# EAGLE design OpenROV Cape (EAGLE 6.2)
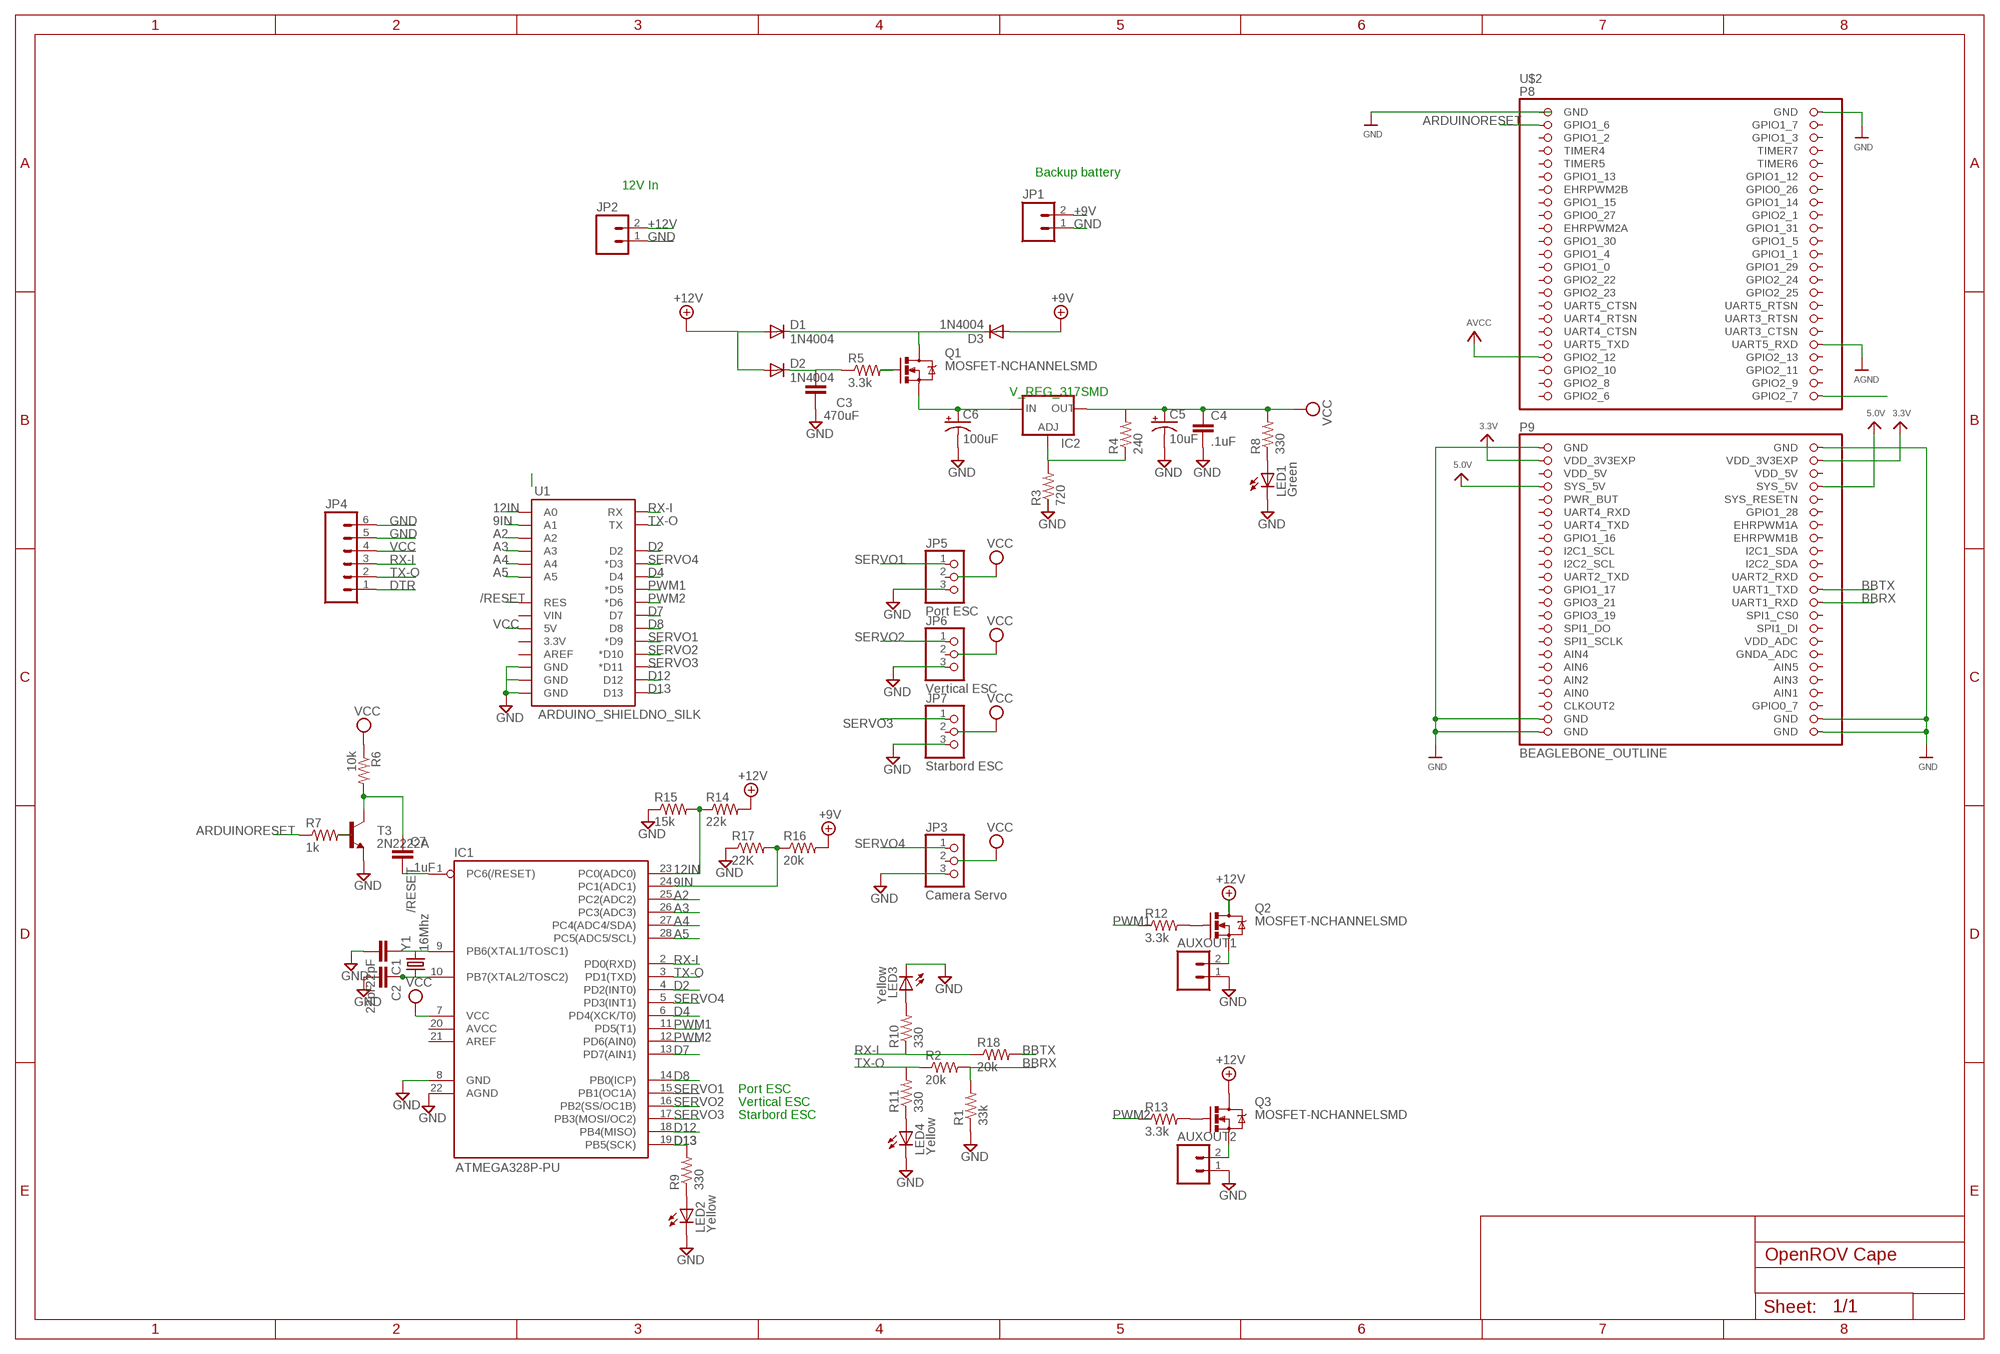
[diagram p0: schematic, sheet 1]

## Parts
AUXOUT1  M02PTH  [1X02]
AUXOUT2  M02PTH  [1X02]
C1  22pF  CAP0805  [0805]
C2  22pF  CAP0805  [0805]
C3  470uF  CAP0805  [0805]
C4  .1uF  CAP0805  [0805]
C5  10uF  CAP_POL1206  [EIA3216]
C6  100uF  CAP_POL1206  [EIA3216]
C7  .1uF  CAP0805  [0805]
D1  1N4004  DIODESMA  [SMA-DIODE]
D2  1N4004  DIODESMA  [SMA-DIODE]
D3  1N4004  DIODESMA  [SMA-DIODE]
IC1  ATMEGA328P-PU  AVR-MEGA8-PPTH  [DIL28-3]
IC2  V_REG_317SMD  [SOT223]
JP1  M02PTH  [1X02]
JP2  M02PTH  [1X02]
JP3  Camera Servo  PINHD-1X3  [1X03]
JP4  M06SIP  [1X06]
JP5  Port ESC  PINHD-1X3  [1X03]
JP6  Vertical ESC  PINHD-1X3  [1X03]
JP7  Starbord ESC  PINHD-1X3  [1X03]
LED1  Green  LED1206  [LED-1206]
LED2  Yellow  LED1206  [LED-1206]
LED3  Yellow  LED1206  [LED-1206]
LED4  Yellow  LED1206  [LED-1206]
Q1  MOSFET-NCHANNELSMD  [SOT23-3]
Q2  MOSFET-NCHANNELSMD  [SOT23-3]
Q3  MOSFET-NCHANNELSMD  [SOT23-3]
R1  33k  RESISTOR0805-RES  [0805]
R2  20k  RESISTOR0805-RES  [0805]
R3  720  RESISTOR0805-RES  [0805]
R4  240  RESISTOR0805-RES  [0805]
R5  3.3k  RESISTOR0805-RES  [0805]
R6  10k  RESISTOR0805-RES  [0805]
R7  1k  RESISTOR0805-RES  [0805]
R8  330  RESISTOR0805-RES  [0805]
R9  330  RESISTOR0805-RES  [0805]
R10  330  RESISTOR0805-RES  [0805]
R11  330  RESISTOR0805-RES  [0805]
R12  3.3k  RESISTOR0805-RES  [0805]
R13  3.3k  RESISTOR0805-RES  [0805]
R14  22k  RESISTOR0805-RES  [0805]
R15  15k  RESISTOR0805-RES  [0805]
R16  20k  RESISTOR0805-RES  [0805]
R17  22K  RESISTOR0805-RES  [0805]
R18  20k  RESISTOR0805-RES  [0805]
T3  2N2222A  TRANSISTOR_NPNSOT23  [SOT23]
U1  ARDUINO_SHIELDNO_SILK  [DUEMILANOVE_VIAS]
U$2  BEAGLEBONE_OUTLINE  [BEAGLEBONE_SHIELD]
Y1  16Mhz  CRYSTALHC49US  [HC49US]

## Nets
3.3V: U$2.49(VDD_3V3EXP) U$2.50(VDD_3V3EXP)
5.0V: U$2.53(SYS_5V) U$2.54(SYS_5V)
9IN: IC1.24(PC1(ADC1)) R16.1 R17.2 U1.A1
12IN: IC1.23(PC0(ADC0)) R14.1 R15.2 U1.A0
+9V: D3.A JP1.2 R16.2
+12V: D1.A D2.A JP2.2 Q2.3(D) Q3.3(D) R14.2
/RESET: C7.1 R6.2 T3.3(C) U1.RES
A2: IC1.25(PC2(ADC2)) U1.A2
A3: IC1.26(PC3(ADC3)) U1.A3
A4: IC1.27(PC4(ADC4/SDA)) U1.A4
A5: IC1.28(PC5(ADC5/SCL)) U1.A5
AGND: U$2.38(UART5_RXD)
ARDUINORESET: R7.1 U$2.3(GPIO1_6)
AVCC: U$2.39(GPIO2_12)
BBRX: R1.2 R2.2 U$2.72(UART1_RXD)
BBTX: R18.2 U$2.70(UART1_TXD)
D2: IC1.4(PD2(INT0)) U1.D2
D4: IC1.6(PD4(XCK/T0)) U1.D4
D7: IC1.13(PD7(AIN1)) U1.D7
D8: IC1.14(PB0(ICP)) U1.D8
D12: IC1.18(PB4(MISO)) U1.D12
D13: IC1.19(PB5(SCK)) R9.2 U1.D13
DTR: JP4.1
GND: AUXOUT1.1 AUXOUT2.1 C1.2 C2.2 C3.2 C4.2 C5.C(-) C6.C(-) IC1.22(AGND) JP1.1 JP2.1 JP3.3 JP4.5 JP4.6 JP5.3 JP6.3 JP7.3 LED1.C LED2.C LED3.C LED4.C R1.1 R3.1 R15.1 R17.1 T3.2(E) U1.GND@0(GND) U1.GND@1(GND) U1.GND@2(GND) U$2.2(GND) U$2.47(GND) U$2.48(GND) U$2.89(GND) U$2.90(GND) U$2.91(GND) U$2.92(GND)
N$1: LED3.A R10.2
N$4: C7.2 IC1.1(PC6(/RESET))
N$5: R7.2 T3.1(B)
N$7: IC2.1(ADJ) R3.2 R4.1
N$9: LED1.A R8.1
N$10: LED2.A R9.1
N$11: LED4.A R11.1
N$12: AUXOUT1.2 Q2.2(S)
N$13: Q2.1(G) R12.2
N$14: AUXOUT2.2 Q3.2(S)
N$15: Q3.1(G) R13.2
N$24: C2.1 IC1.10(PB7(XTAL2/TOSC2)) Y1.1
N$25: C1.1 IC1.9(PB6(XTAL1/TOSC1)) Y1.2
N$46: U$2.46(GPIO2_7)
N$71: C3.1 D2.C R5.1
N$73: Q1.1(G) R5.2
N$90: D1.C D3.C Q1.3(D)
N$91: C6.A(+) IC2.3(IN) Q1.2(S)
PWM1: IC1.11(PD5(T1)) R12.1 U1.D5(*D5)
PWM2: IC1.12(PD6(AIN0)) R13.1 U1.D6(*D6)
RX-I: IC1.2(PD0(RXD)) JP4.3 R10.1 R18.1 U1.RX
SERVO1: IC1.15(PB1(OC1A)) JP5.1 U1.D9(*D9)
SERVO2: IC1.16(PB2(SS/OC1B)) JP6.1 U1.D10(*D10)
SERVO3: IC1.17(PB3(MOSI/OC2)) JP7.1 U1.D11(*D11)
SERVO4: IC1.5(PD3(INT1)) JP3.1 U1.D3(*D3)
TX-O: IC1.3(PD1(TXD)) JP4.2 R2.1 R11.2 U1.TX
VCC: C4.1 C5.A(+) IC1.7(VCC) IC2.2(OUT) JP4.4 R4.2 R6.1 R8.2 U1.5V
Unconnected: IC1.8(GND) IC1.20(AVCC) IC1.21(AREF) JP3.2 JP5.2 JP6.2 JP7.2 U1.3.3V U1.AREF U1.VIN U$2.5(GPIO1_2) U$2.6(GPIO1_3) U$2.7(TIMER4) U$2.8(TIMER7) U$2.9(TIMER5) U$2.10(TIMER6) U$2.11(GPIO1_13) U$2.12(GPIO1_12) U$2.13(EHRPWM2B) U$2.14(GPIO0_26) U$2.15(GPIO1_15) U$2.16(GPIO1_14) U$2.17(GPIO0_27) U$2.18(GPIO2_1) U$2.19(EHRPWM2A) U$2.20(GPIO1_31) U$2.21(GPIO1_30) U$2.22(GPIO1_5) U$2.23(GPIO1_4) U$2.24(GPIO1_1) U$2.25(GPIO1_0) U$2.26(GPIO1_29) U$2.27(GPIO2_22) U$2.28(GPIO2_24) U$2.29(GPIO2_23) U$2.30(GPIO2_25) U$2.31(UART5_CTSN) U$2.32(UART5_RTSN) U$2.33(UART4_RTSN) U$2.34(UART3_RTSN) U$2.35(UART4_CTSN) U$2.36(UART3_CTSN) U$2.37(UART5_TXD) U$2.40(GPIO2_13) U$2.41(GPIO2_10) U$2.55(PWR_BUT) U$2.56(SYS_RESETN) U$2.57(UART4_RXD) U$2.58(GPIO1_28) U$2.59(UART4_TXD) U$2.60(EHRPWM1A) U$2.61(GPIO1_16) U$2.62(EHRPWM1B) U$2.63(I2C1_SCL) U$2.64(I2C1_SDA) U$2.65(I2C2_SCL) U$2.66(I2C2_SDA) U$2.67(UART2_TXD) U$2.68(UART2_RXD) U$2.69(GPIO1_17) U$2.71(GPIO3_21) U$2.73(GPIO3_19) U$2.74(SPI1_CS0) U$2.75(SPI1_DO) U$2.76(SPI1_DI) U$2.77(SPI1_SCLK) U$2.78(VDD_ADC) U$2.79(AIN4) U$2.80(GNDA_ADC) U$2.81(AIN6) U$2.82(AIN5) U$2.83(AIN2) U$2.86(AIN1) U$2.87(CLKOUT2) U$2.88(GPIO0_7)

## Notes on the sheet
- Backup battery
- 12V In
- V_REG_317SMD
- Port ESC
- Vertical ESC
- Starbord ESC

## Power pins joined to a net without a drawn wire
AIN0: U$2.85(AIN0)
AIN3: U$2.84(AIN3)
GND: U$2.1(GND)
GPIO1_7: U$2.4(GPIO1_7)
GPIO2_6: U$2.45(GPIO2_6)
GPIO2_8: U$2.43(GPIO2_8)
GPIO2_9: U$2.44(GPIO2_9)
GPIO2_11: U$2.42(GPIO2_11)
VDD_5V: U$2.51(VDD_5V) U$2.52(VDD_5V)

## Library data of the parts
AUXOUT1 AUXOUT2 JP1 JP2 = SparkFun:M02: Header 2 Standard 2-pin 0.1" header. Use with straight break away headers (SKU : PRT-00116), right angle break away headers (PRT-00553), swiss pins (PRT-00743), machine pins (PRT-00117), and female headers (PRT-00115). Molex polarized connector foot print use with SKU : PRT-08233 with associated crimp pins and housings.
C1-C4 C7 = SparkFun-Passives:CAP: Capacitor Standard 0603 ceramic capacitor, and 0.1" leaded capacitor.
C5 C6 = SparkFun-Passives:CAP_POL: Capacitor Polarized These are standard SMD and PTH capacitors. Normally 10uF, 47uF, and 100uF in electrolytic and tantalum varieties. Always verify the external diameter of the through hole cap, it varies with capacity, voltage, and manufacturer. The EIA devices should be standard.
D1-D3 = SparkFun-DiscreteSemi:DIODE: Diode These are standard reverse protection diodes and small signal diodes. SMA package can handle up to about 1A. SOD-323 can handle about 200mA. What the SOD-323 package when ordering, there are some mfgs out there that are 5-pin packages.
IC1 = SparkFun:AVR-MEGA8-P: MICROCONTROLLER 8 Kbytes FLASH 1 kbytes SRAM 512 bytes EEPROM USART 4-channel 10 bit ADC 2-channel 8 bit ADC
IC2 = SparkFun-PowerIC:V_REG_317: Voltage Regulator Standard LM317 adjustable voltage regulator. AOI (Adjust Output Input). Google 'LM317 Calculator' for easy to use app to get the two resistor values needed. 240/720 for 5V output. 240/390 for 3.3V output. Spark Fun Electronics SKU : COM-00527
JP3 JP5-JP7 = pinhead:PINHD-1X3: PIN HEADER
JP4 = SparkFun-Connectors:M06: Header 6 Standard 6-pin 0.1" header. Use with straight break away headers (SKU : PRT-00116), right angle break away headers (PRT-00553), swiss pins (PRT-00743), machine pins (PRT-00117), and female headers (PRT-00115). Molex polarized connector foot print use with SKU : PRT-08094 with associated crimp pins and housings. NOTES ON THE VARIANTS LOCK and LOCK_LONGPADS... This footprint was designed to help hold the alignment of a through-hole component (i.e. 6-pin header) while soldering it into place. You may notice that each hole has been shifted either up or down by 0.005 of an inch from it's more standard position (which is a perfectly straight line). This slight alteration caused the pins (the squares in the middle) to touch the edges of the holes. Because they are alternating, it causes a "brace" to hold the component in place. 0.005 has proven to be the perfect amount of "off-center" position when using our standard breakaway headers. Although looks a little odd when you look at the bare footprint, once you have a header in there, the alteration is very hard to notice. Also, if you push a header all the way into place, it is covered up entirely on the bottom side. This idea of altering the position of holes to aid alignment will be further integrated into the Sparkfun Library for other footprints. It can help hold any component with 3 or more connection pins.
LED1-LED4 = SparkFun-LED:LED: LEDs Standard schematic elements and footprints for 5mm, 3mm, 1206, and 0603 sized LEDs. 5mm - Spark Fun Electronics SKU : COM-00529 (and others)
Q1-Q3 = SparkFun-DiscreteSemi:MOSFET-NCHANNEL: Generic NMOS footprint
R1-R18 = SparkFun-Passives:RESISTOR: Resistor Basic schematic elements and footprints for 0603, 1206, and PTH resistors.
T3 = SparkFun-DiscreteSemi:TRANSISTOR_NPN: Generic NPN BJT. MMBT2222 is the common NPN we use. Double check against datasheet- not all devices are the same!
U1 = SparkFun-Boards:ARDUINO_SHIELD: Arduino shield footprint
U$2 = microbuilder:BEAGLEBONE_OUTLINE
Y1 = SparkFun:CRYSTAL: Crystals Various standard crystals. Proven footprints. Spark Fun Electronics SKU : COM-00534

## Board
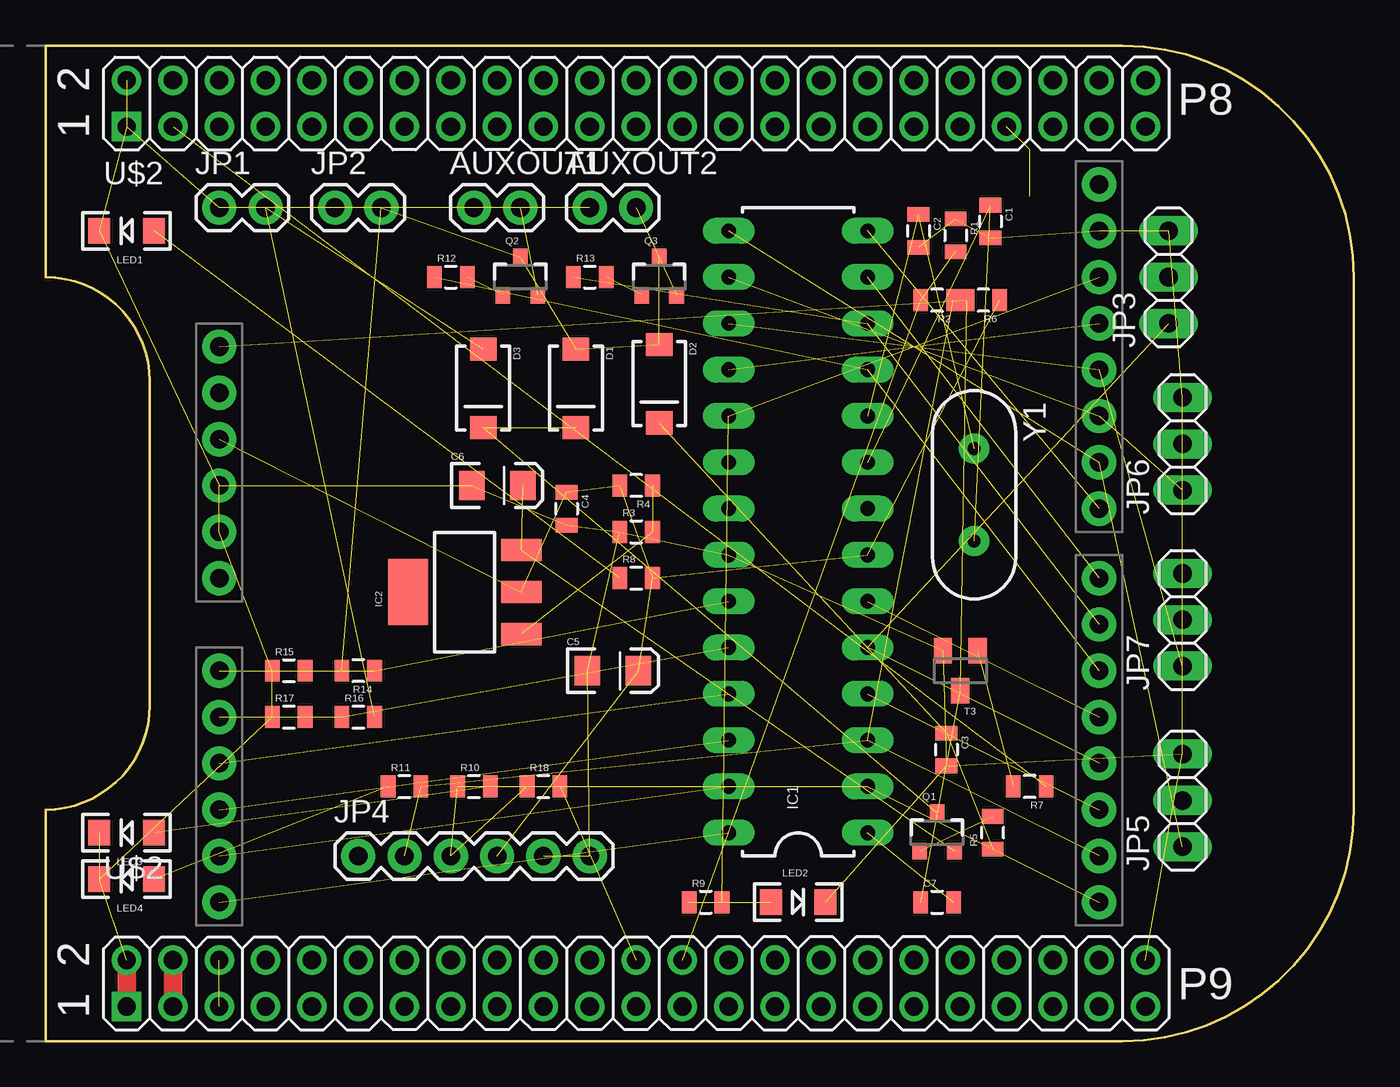
[diagram p1: board, top side]
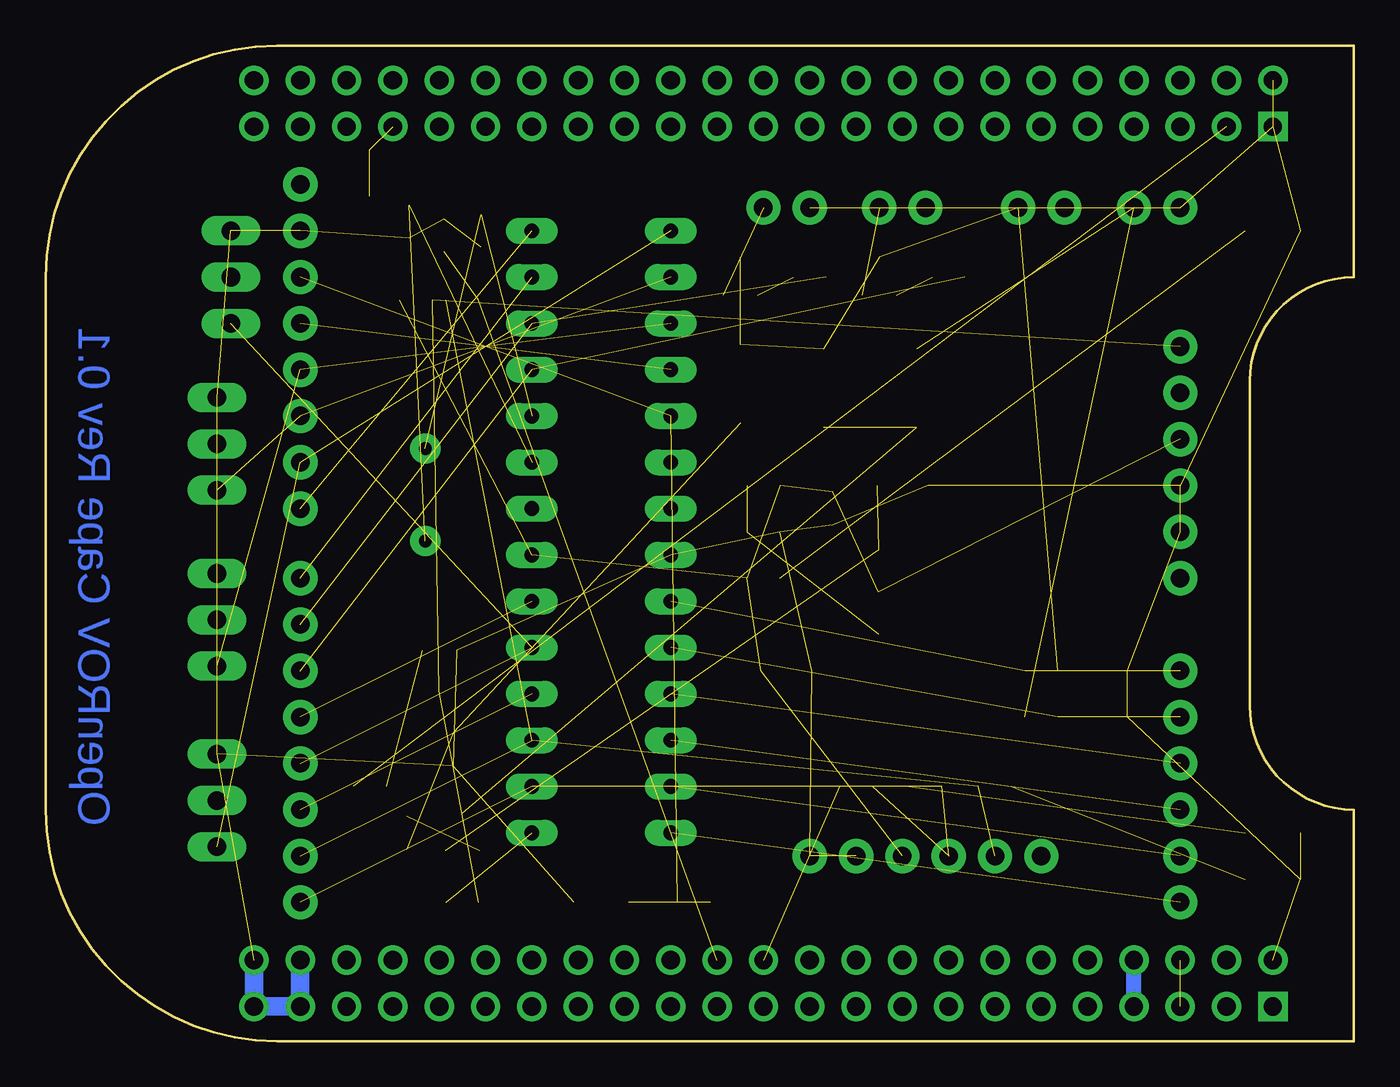
[diagram p2: board, bottom side, seen from below]

Size 71.75 x 54.61 mm. Coordinates in mm from the lower left corner, seen from the top.
Copper layers (1*16): Top 0.035mm / dielectric 1.5mm / Bottom 0.035mm
Design rules: minimum track width 10mil, minimum drill 20mil, track to track 10mil, track to pad 10mil, pad to pad 10mil, via to via 10mil, smd to smd 10mil, copper to edge 10mil, drill to drill 10mil, minimum pad ring 12mil, minimum via ring 10mil, stop-mask expansion 4mil, vias tented up to drill 25mil, thermal gap 10mil

### Footprints (pad centres in the part's own frame; a part is rotated, then mirrored left to right if it is on the bottom)
1X02 = drill 1.016 pad 1.88: 1 0,0; 2 2.54,0
0805 = smd 0.8 x 1.2: 1 -0.9,0; 2 0.9,0
EIA3216 = smd 1.4 x 1.6: A 1.4,0; C -1.4,0
SMA-DIODE = smd 1.27 x 1.47: A -2.15,0; C 2.15,0
DIL28-3 = drill 0.813 long: 1 -16.51,-3.81; 2 -13.97,-3.81; 3 -11.43,-3.81; 4 -8.89,-3.81; 5 -6.35,-3.81; 6 -3.81,-3.81; 7 -1.27,-3.81; 8 1.27,-3.81; 9 3.81,-3.81; 10 6.35,-3.81; 11 8.89,-3.81; 12 11.43,-3.81; 13 13.97,-3.81; 14 16.51,-3.81; 15 16.51,3.81; 16 13.97,3.81; 17 11.43,3.81; 18 8.89,3.81; 19 6.35,3.81; 20 3.81,3.81; 21 1.27,3.81; 22 -1.27,3.81; 23 -3.81,3.81; 24 -6.35,3.81; 25 -8.89,3.81; 26 -11.43,3.81; 27 -13.97,3.81; 28 -16.51,3.81
SOT223 = smd 1.219 x 2.235: 1 -2.311,-3.099; 2 0,-3.099; 3 2.311,-3.099 | smd 3.6 x 2.2: 4 0,3.099
1X03 = drill 1.016 long: 1 -2.54,0; 2 0,0; 3 2.54,0
1X06 = drill 1.016 pad 1.88: 1 0,0; 2 2.54,0; 3 5.08,0; 4 7.62,0; 5 10.16,0; 6 12.7,0
LED-1206 = smd 1.2 x 1.4: A -1.5,0; C 1.5,0
SOT23-3 = smd 0.8 x 0.9: 1 -0.95,-1; 2 0.95,-1; 3 0,1.1
SOT23 = smd 1 x 1.4: 1 -0.95,-1.1; 2 0.95,-1.1; 3 0,1.1
DUEMILANOVE_VIAS = drill 1.016 pad 1.88: 3.3V 50.8,13.97; 5V 50.8,16.51; A0 50.8,29.21; A1 50.8,31.75; A2 50.8,34.29; A3 50.8,36.83; A4 50.8,39.37; A5 50.8,41.91; AREF 2.54,2.54; D2 2.54,36.83; D3 2.54,34.29; D4 2.54,31.75; D5 2.54,29.21; D6 2.54,26.67; D7 2.54,24.13; D8 2.54,20.32; D9 2.54,17.78; D10 2.54,15.24; D11 2.54,12.7; D12 2.54,10.16; D13 2.54,7.62; GND@0 50.8,19.05; GND@1 50.8,21.59; GND@2 2.54,5.08; RES 50.8,11.43; RX 2.54,41.91; TX 2.54,39.37; VIN 50.8,24.13
BEAGLEBONE_SHIELD = drill 1 square: 1 4.445,19.05; 47 52.705,19.05 | drill 1: 2 1.905,19.05; 3 4.445,21.59; 4 1.905,21.59; 5 4.445,24.13; 6 1.905,24.13; 7 4.445,26.67; 8 1.905,26.67; 9 4.445,29.21; 10 1.905,29.21; 11 4.445,31.75; 12 1.905,31.75; 13 4.445,34.29; 14 1.905,34.29; 15 4.445,36.83; 16 1.905,36.83; 17 4.445,39.37; 18 1.905,39.37; 19 4.445,41.91; 20 1.905,41.91; 21 4.445,44.45; 22 1.905,44.45; 23 4.445,46.99; 24 1.905,46.99; 25 4.445,49.53; 26 1.905,49.53; 27 4.445,52.07; 28 1.905,52.07; 29 4.445,54.61; 30 1.905,54.61; 31 4.445,57.15; 32 1.905,57.15; 33 4.445,59.69; 34 1.905,59.69; 35 4.445,62.23; 36 1.905,62.23; 37 4.445,64.77; 38 1.905,64.77; 39 4.445,67.31; 40 1.905,67.31; 41 4.445,69.85; 42 1.905,69.85; 43 4.445,72.39; 44 1.905,72.39; 45 4.445,74.93; 46 1.905,74.93; 48 50.165,19.05; 49 52.705,21.59; 50 50.165,21.59; 51 52.705,24.13; 52 50.165,24.13; 53 52.705,26.67; 54 50.165,26.67; 55 52.705,29.21; 56 50.165,29.21; 57 52.705,31.75; 58 50.165,31.75; 59 52.705,34.29; 60 50.165,34.29; 61 52.705,36.83; 62 50.165,36.83; 63 52.705,39.37; 64 50.165,39.37; 65 52.705,41.91; 66 50.165,41.91; 67 52.705,44.45; 68 50.165,44.45; 69 52.705,46.99; 70 50.165,46.99; 71 52.705,49.53; 72 50.165,49.53; 73 52.705,52.07; 74 50.165,52.07; 75 52.705,54.61; 76 50.165,54.61; 77 52.705,57.15; 78 50.165,57.15; 79 52.705,59.69; 80 50.165,59.69; 81 52.705,62.23; 82 50.165,62.23; 83 52.705,64.77; 84 50.165,64.77; 85 52.705,67.31; 86 50.165,67.31; 87 52.705,69.85; 88 50.165,69.85; 89 52.705,72.39; 90 50.165,72.39; 91 52.705,74.93; 92 50.165,74.93
HC49US = drill 0.7 pad 1.651: 1 -2.54,0; 2 2.54,0

### Placement (x,y rotation side)
AUXOUT1  23.5,45.72 0 top
AUXOUT2  29.85,45.72 0 top
C1  51.82,44.96 270 top
C2  47.88,44.45 270 top
C3  49.4,16 270 top
C4  28.57,29.21 270 top
C5  31.11,20.32 0 top
C6  24.76,30.48 0 top
C7  48.89,7.62 0 top
D1  29.08,35.81 270 top
D2  33.66,36.07 270 top
D3  24,35.81 270 top
IC1  41.28,27.94 90 top
IC2  22.99,24.64 90 top
JP1  9.52,45.72 0 top
JP2  15.88,45.72 0 top
JP3  61.59,41.91 90 top
JP4  17.14,10.16 0 top
JP5  62.36,13.21 90 top
JP6  62.36,32.77 90 top
JP7  62.36,23.11 90 top
LED1  4.45,44.45 180 top
LED2  41.28,7.62 0 top
LED3  4.45,11.43 180 top
LED4  4.45,8.89 180 top
Q1  48.89,11.43 0 top
Q2  26.04,41.91 0 top
Q3  33.66,41.91 0 top
R1  49.91,44.2 270 top
R2  48.89,40.64 180 top
R3  32.39,27.94 0 top
R4  32.39,30.48 180 top
R5  51.94,11.43 90 top
R6  51.44,40.64 180 top
R7  53.97,13.97 180 top
R8  32.39,25.4 0 top
R9  36.19,7.62 0 top
R10  23.5,13.97 0 top
R11  19.68,13.97 0 top
R12  22.22,41.91 0 top
R13  29.85,41.91 0 top
R14  17.14,20.32 180 top
R15  13.34,20.32 0 top
R16  17.14,17.78 0 top
R17  13.34,17.78 0 top
R18  27.3,13.97 0 top
T3  50.16,20.32 180 top
U1  60.33,49.53 180 top
U$2  -14.61,54.61 270 top
Y1  50.93,29.97 270 top

### Tracks (layer width: path | path; a pad name or v marks a point on that pad's centre or on a via)
3.3V
  Top 1.016: U$2.49 U$2.50
5.0V
  Bottom 0.813: U$2.53 U$2.54
9IN  (3 unrouted)
12IN  (3 unrouted)
+9V  (2 unrouted)
+12V  (5 unrouted)
/RESET  (3 unrouted)
A2  (1 unrouted)
A3  (1 unrouted)
A4  (1 unrouted)
A5  (1 unrouted)
ARDUINORESET  (1 unrouted)
AVCC  (2 unrouted)
BBRX  (2 unrouted)
BBTX  (1 unrouted)
D2  (1 unrouted)
D4  (1 unrouted)
D7  (1 unrouted)
D8  (1 unrouted)
D12  (1 unrouted)
D13  (2 unrouted)
GND  (32 unrouted)
  Top 1.016: U$2.47 U$2.48
  Bottom 1.016: U$2.92 U$2.91 U$2.89 U$2.90
N$1  (1 unrouted)
N$4  (1 unrouted)
N$5  (1 unrouted)
N$7  (2 unrouted)
N$9  (1 unrouted)
N$10  (1 unrouted)
N$11  (1 unrouted)
N$12  (1 unrouted)
N$13  (1 unrouted)
N$14  (1 unrouted)
N$15  (1 unrouted)
N$24  (2 unrouted)
N$25  (2 unrouted)
N$71  (2 unrouted)
N$73  (1 unrouted)
N$90  (2 unrouted)
N$91  (2 unrouted)
PWM1  (2 unrouted)
PWM2  (2 unrouted)
RX-I  (4 unrouted)
SERVO1  (2 unrouted)
SERVO2  (2 unrouted)
SERVO3  (2 unrouted)
SERVO4  (2 unrouted)
TX-O  (4 unrouted)
VCC  (8 unrouted)
VDD_5V  (1 unrouted)

### Text on the board
Bottom: OpenROV Cape Rev 0.1
tPlace: 2 | P8 | 1 | 2 | P9 | 1